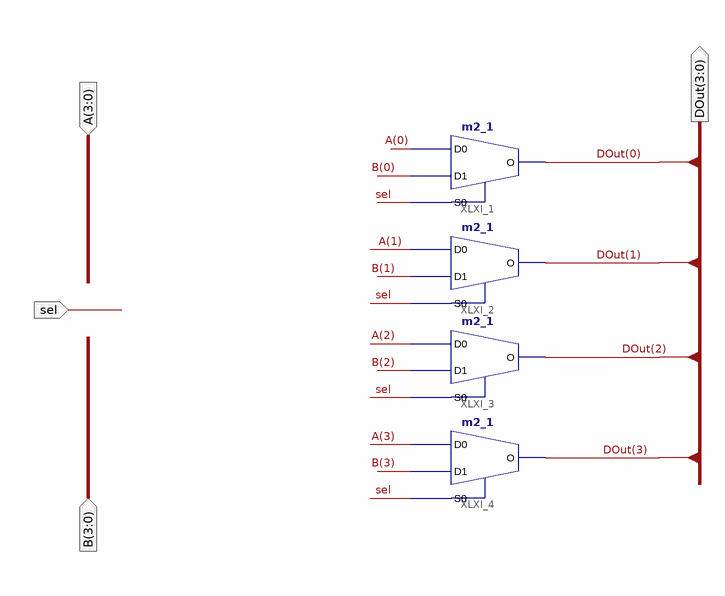
[diagram p0: schematic sheet 1]
// Xilinx ISE schematic mux4x2to1.sch (spartan3e) as structural Verilog: 4 symbols, 4 ports
module mux4x2to1 (
  input  [3:0] A,
  input  [3:0] B,
  input  sel,
  output [3:0] DOut
);

  m2_1 XLXI_1 (.D0(A[0]), .D1(B[0]), .S0(sel), .O(DOut[0]));
  m2_1 XLXI_2 (.D0(A[1]), .D1(B[1]), .S0(sel), .O(DOut[1]));
  m2_1 XLXI_3 (.D0(A[2]), .D1(B[2]), .S0(sel), .O(DOut[2]));
  m2_1 XLXI_4 (.D0(A[3]), .D1(B[3]), .S0(sel), .O(DOut[3]));
endmodule
